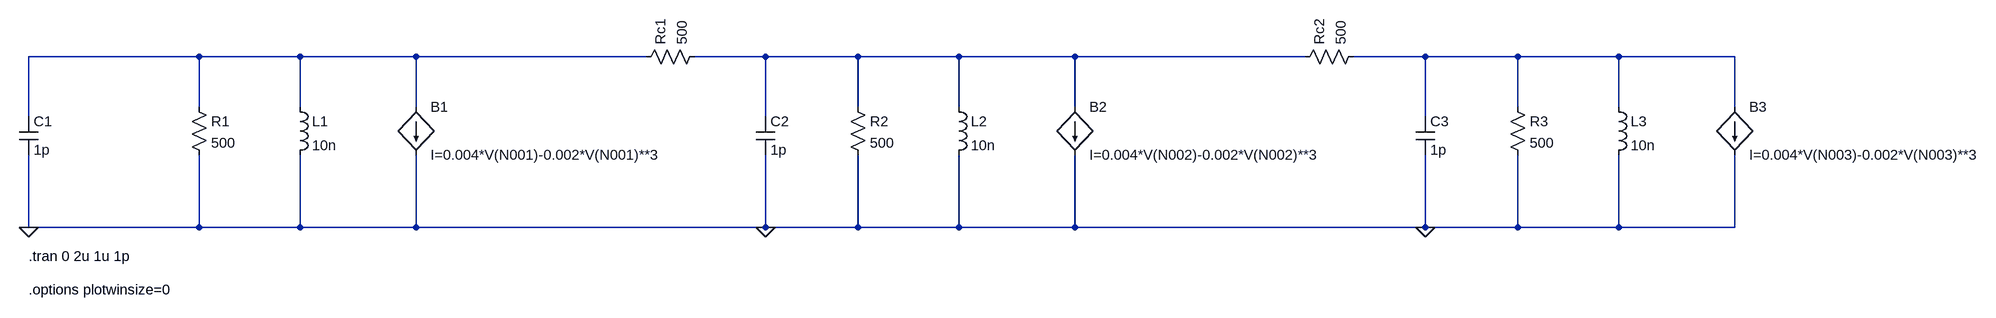
[diagram p0: schematic wilhelmina_array.asc]
wilhelmina_array.asc, the LTspice schematic file:
Version 4.1
SHEET 1 5164 1000
WIRE 500 100 216 100
WIRE 800 100 500 100
WIRE 1100 100 800 100
WIRE 1484 100 1100 100
WIRE 2016 100 1564 100
WIRE 2300 100 2016 100
WIRE 2600 100 2300 100
WIRE 2900 100 2600 100
WIRE 3284 100 2900 100
WIRE 3816 100 3364 100
WIRE 4100 100 3816 100
WIRE 4400 100 4100 100
WIRE 4700 100 4400 100
WIRE 500 184 500 100
WIRE 800 184 800 100
WIRE 1100 184 1100 100
WIRE 2300 184 2300 100
WIRE 2600 184 2600 100
WIRE 2900 184 2900 100
WIRE 4100 184 4100 100
WIRE 4400 184 4400 100
WIRE 4700 184 4700 100
WIRE 216 200 216 100
WIRE 2016 200 2016 100
WIRE 3816 200 3816 100
WIRE 216 400 216 264
WIRE 500 400 500 264
WIRE 500 400 216 400
WIRE 800 400 800 264
WIRE 800 400 500 400
WIRE 1100 400 1100 264
WIRE 1100 400 800 400
WIRE 2016 400 2016 264
WIRE 2016 400 1100 400
WIRE 2300 400 2300 264
WIRE 2300 400 2016 400
WIRE 2600 400 2600 264
WIRE 2600 400 2300 400
WIRE 2900 400 2900 264
WIRE 2900 400 2600 400
WIRE 3816 400 3816 264
WIRE 3816 400 2900 400
WIRE 4100 400 4100 264
WIRE 4100 400 3816 400
WIRE 4400 400 4400 264
WIRE 4400 400 4100 400
WIRE 4700 400 4700 264
WIRE 4700 400 4400 400
FLAG 216 400 0
FLAG 2016 400 0
FLAG 3816 400 0
SYMBOL cap 200 200 R0
SYMATTR InstName C1
SYMATTR Value 1p
SYMBOL res 484 168 R0
SYMATTR InstName R1
SYMATTR Value 500
SYMBOL ind 784 168 R0
SYMATTR InstName L1
SYMATTR Value 10n
SYMBOL bi 1100 184 R0
SYMATTR InstName B1
SYMATTR Value I=0.004*V(N001)-0.002*V(N001)**3
SYMBOL res 1468 116 R270
SYMATTR InstName Rc1
SYMATTR Value 500
SYMBOL cap 2000 200 R0
SYMATTR InstName C2
SYMATTR Value 1p
SYMBOL res 2284 168 R0
SYMATTR InstName R2
SYMATTR Value 500
SYMBOL ind 2584 168 R0
SYMATTR InstName L2
SYMATTR Value 10n
SYMBOL bi 2900 184 R0
SYMATTR InstName B2
SYMATTR Value I=0.004*V(N002)-0.002*V(N002)**3
SYMBOL res 3268 116 R270
SYMATTR InstName Rc2
SYMATTR Value 500
SYMBOL cap 3800 200 R0
SYMATTR InstName C3
SYMATTR Value 1p
SYMBOL res 4084 168 R0
SYMATTR InstName R3
SYMATTR Value 500
SYMBOL ind 4384 168 R0
SYMATTR InstName L3
SYMATTR Value 10n
SYMBOL bi 4700 184 R0
SYMATTR InstName B3
SYMATTR Value I=0.004*V(N003)-0.002*V(N003)**3
TEXT 216 448 Left 2 !.tran 0 2u 1u 1p
TEXT 216 504 Left 2 !.options plotwinsize=0

The netlist it stands for:
* wilhelmina_array.asc
C1 N001 0 1p
R1 N001 0 500
L1 N001 0 10n
B1 N001 0 I=0.004*V(N001)-0.002*V(N001)**3
Rc1 N001 N002 500
C2 N002 0 1p
R2 N002 0 500
L2 N002 0 10n
B2 N002 0 I=0.004*V(N002)-0.002*V(N002)**3
Rc2 N002 N003 500
C3 N003 0 1p
R3 N003 0 500
L3 N003 0 10n
B3 N003 0 I=0.004*V(N003)-0.002*V(N003)**3
.tran 0 2u 1u 1p
.options plotwinsize=0
.backanno
.end